# EAGLE design BattleBits_V3_partlyRouted (EAGLE 9.3.2)
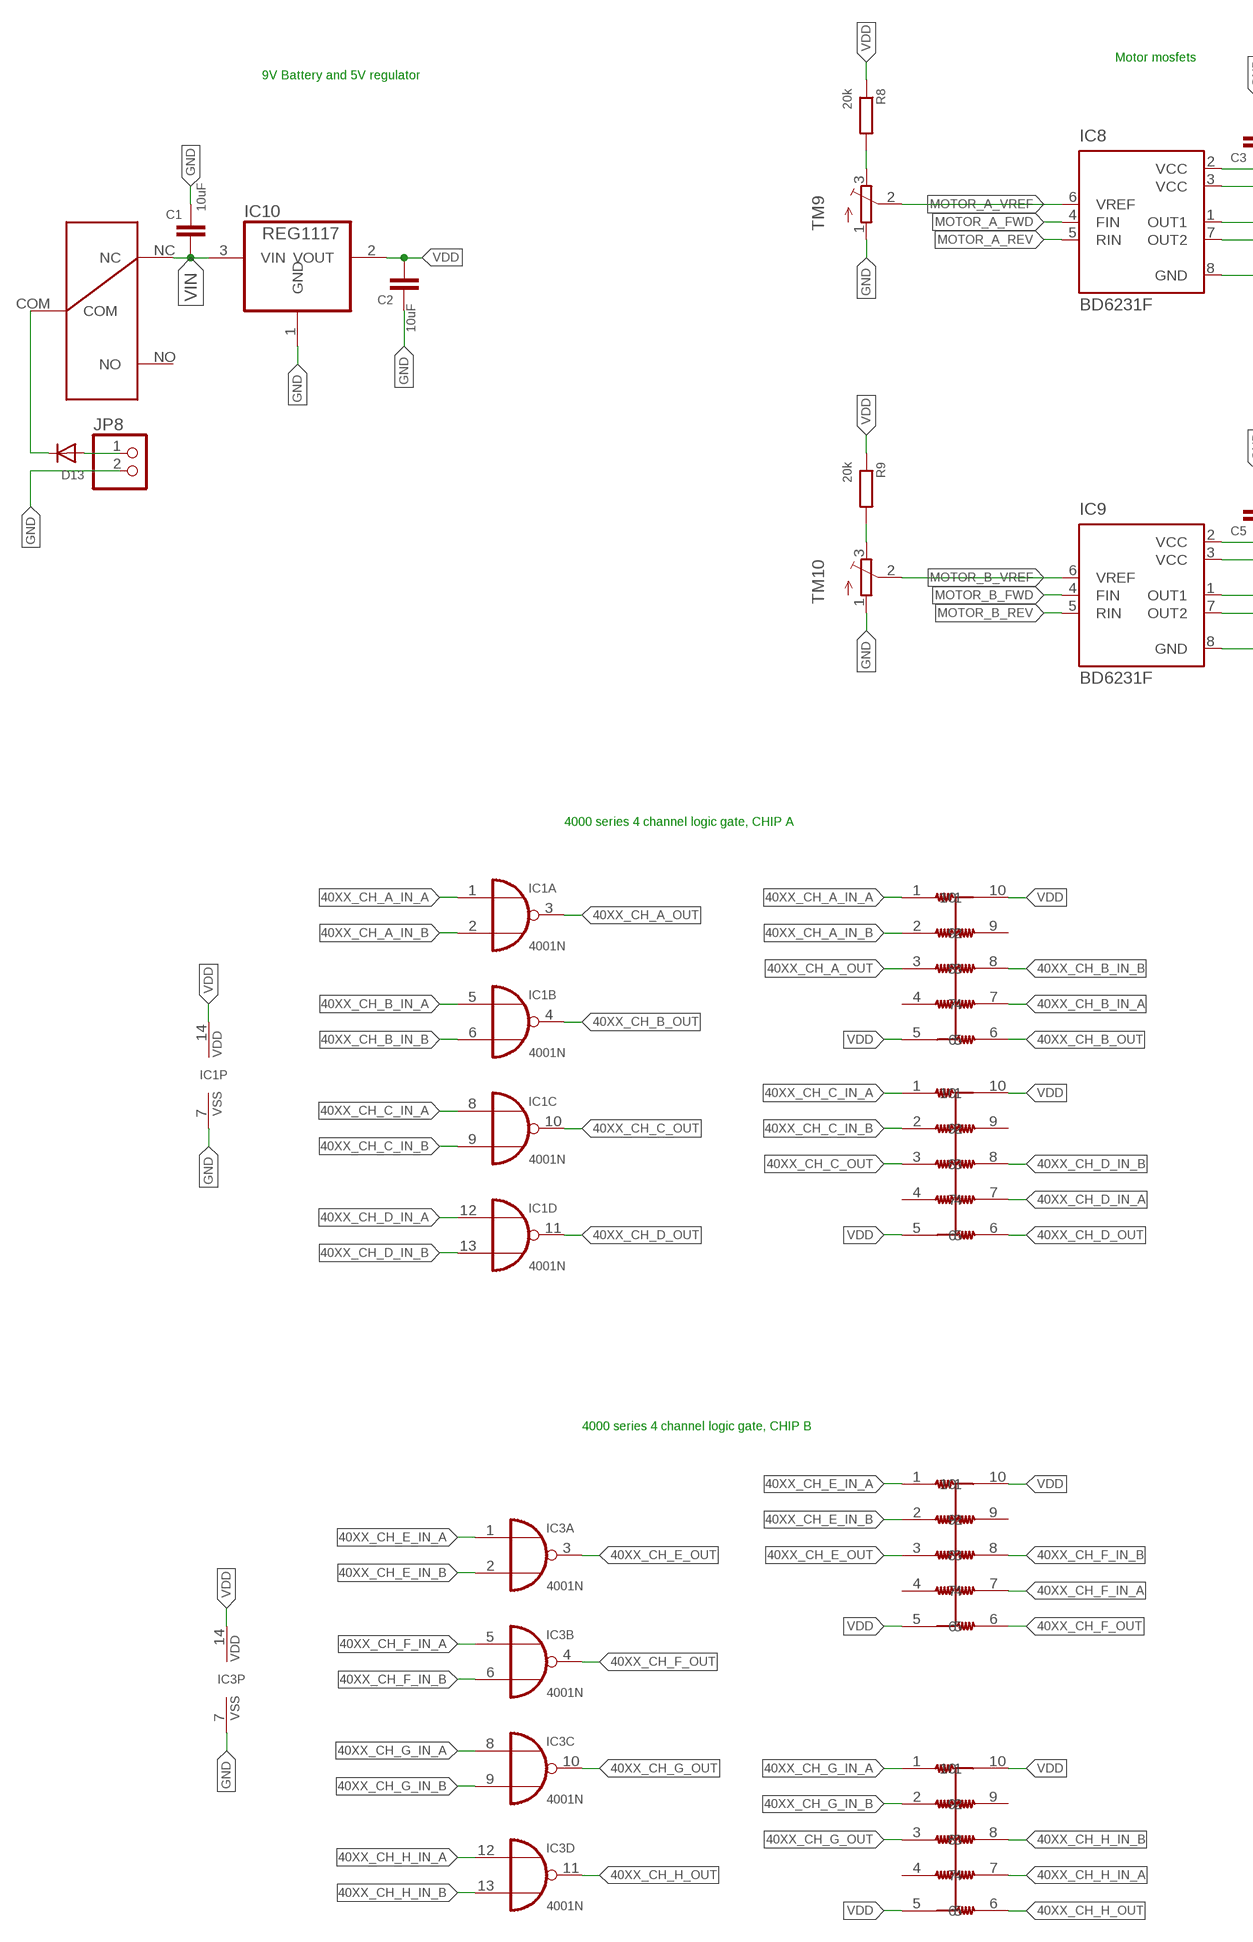
[diagram p0: schematic, sheet 1, part 1 of 2]
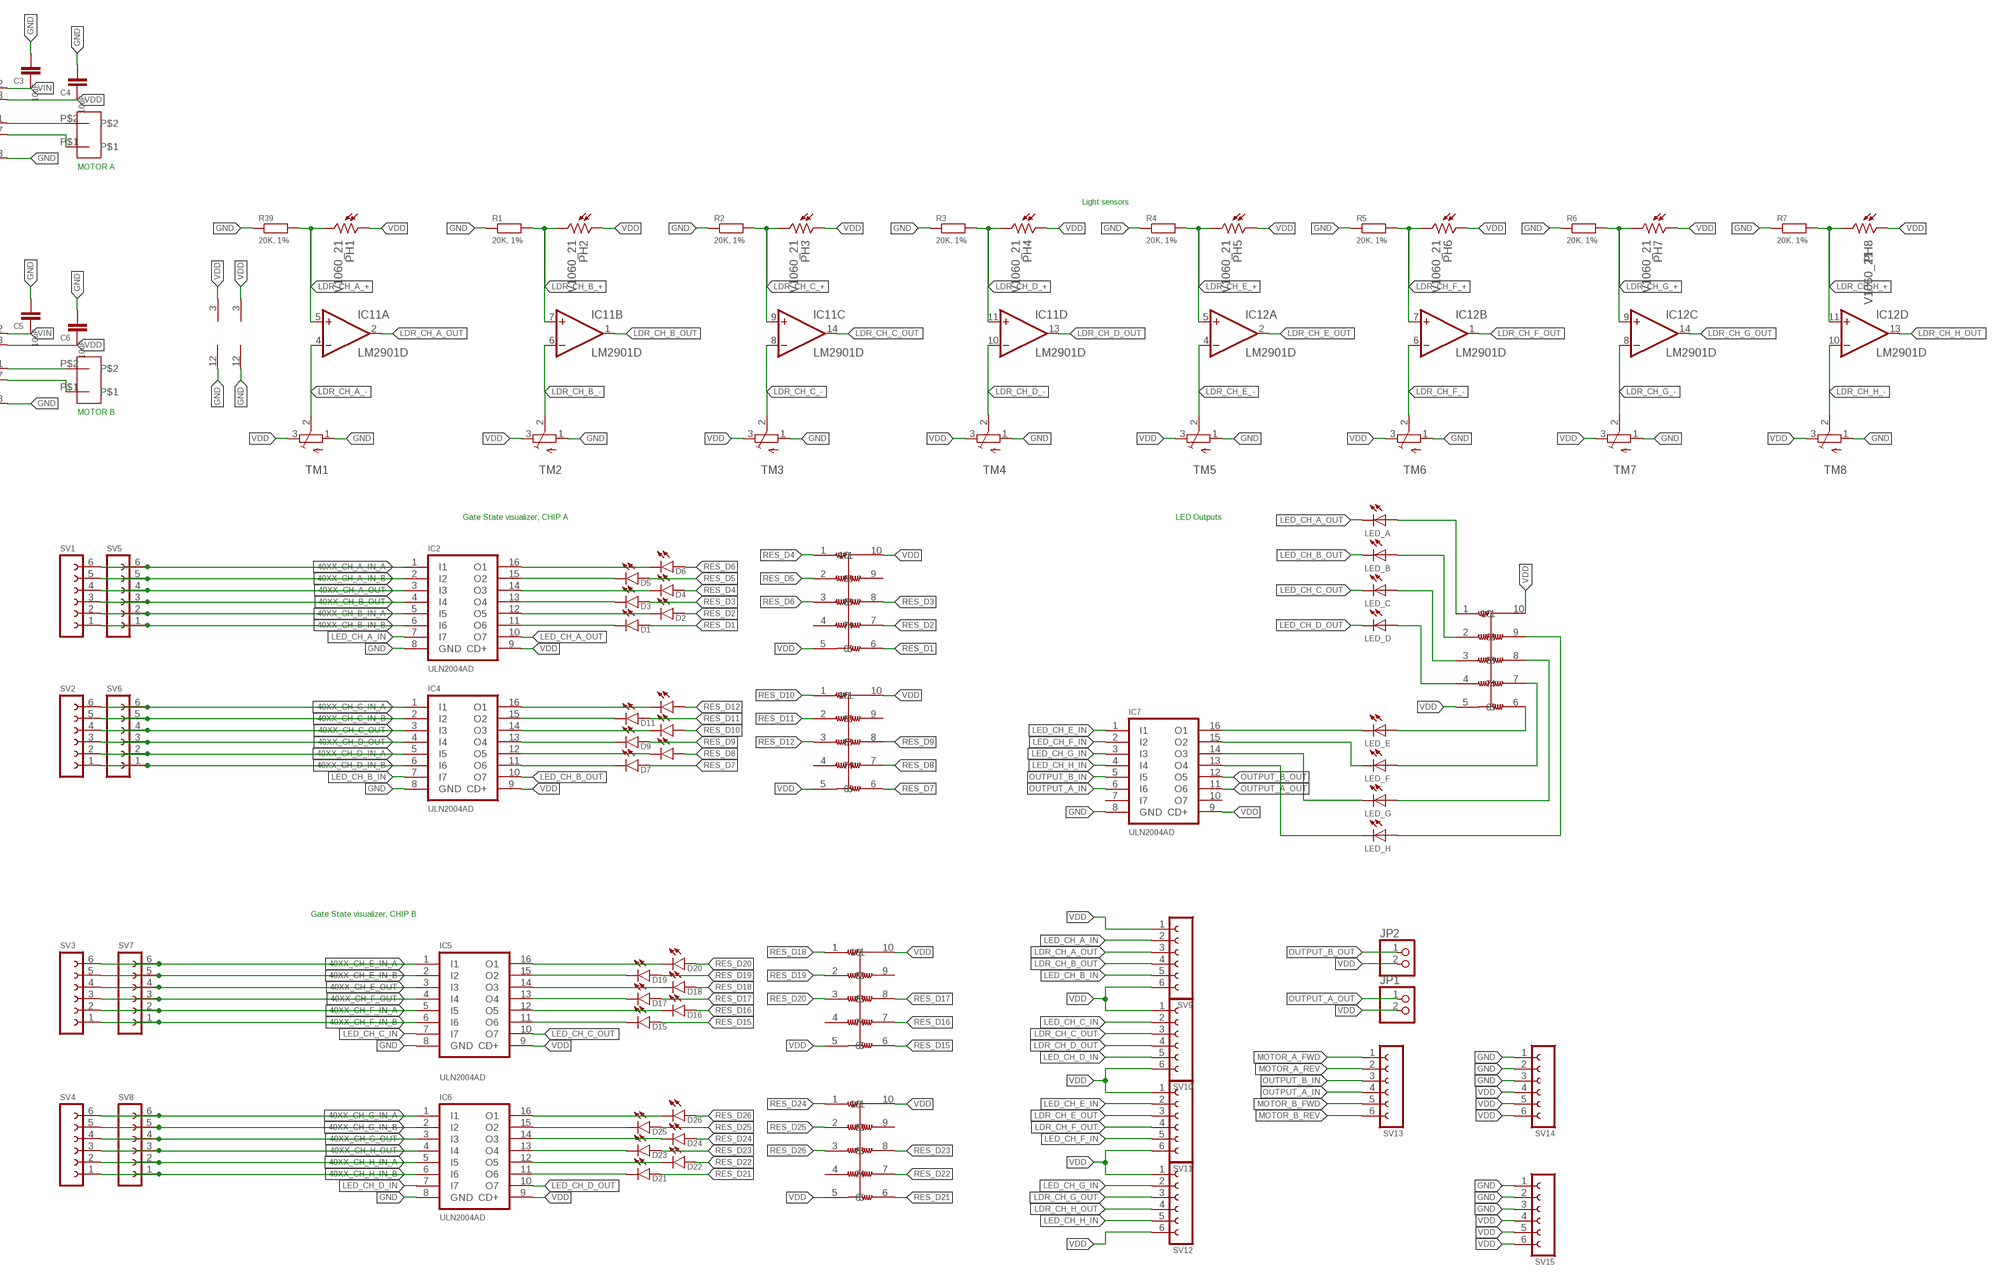
[diagram p1: schematic, sheet 1, part 2 of 2]

## Parts
C1  10uF  C-EUC3216  [C3216]
C2  10uF  C-EUC3216  [C3216]
C3  10uF  C-EUC3216  [C3216]
C4  10uF  C-EUC3216  [C3216]
C5  10uF  C-EUC3216  [C3216]
C6  10uF  C-EUC3216  [C3216]
D1  LED1206  [LED-1206]
D2  LED1206  [LED-1206]
D3  LED1206  [LED-1206]
D4  LED1206  [LED-1206]
D5  LED1206  [LED-1206]
D6  LED1206  [LED-1206]
D7  LED1206  [LED-1206]
D8  LED1206  [LED-1206]
D9  LED1206  [LED-1206]
D10  LED1206  [LED-1206]
D11  LED1206  [LED-1206]
D12  LED1206  [LED-1206]
D13  DIODESMA  [SMADIODE]
D15  LED1206  [LED-1206]
D16  LED1206  [LED-1206]
D17  LED1206  [LED-1206]
D18  LED1206  [LED-1206]
D19  LED1206  [LED-1206]
D20  LED1206  [LED-1206]
D21  LED1206  [LED-1206]
D22  LED1206  [LED-1206]
D23  LED1206  [LED-1206]
D24  LED1206  [LED-1206]
D25  LED1206  [LED-1206]
D26  LED1206  [LED-1206]
IC1  4001N  [DIL14]
IC2  ULN2004AD  [SO16]
IC3  4001N  [DIL14]
IC4  ULN2004AD  [SO16]
IC5  ULN2004AD  [SO16]
IC6  ULN2004AD  [SO16]
IC7  ULN2004AD  [SO16]
IC8  BD6231F  [SOP8]
IC9  BD6231F  [SOP8]
IC10  REG1117  [SOT223]
IC11  LM2901D  [SO14]
IC12  LM2901D  [SO14]
JP1  PINHD-1X2  [1X02]
JP2  PINHD-1X2  [1X02]
JP8  PINHD-1X2  [1X02]
LED_A  LED5MM  [LED5MM]
LED_B  LED5MM  [LED5MM]
LED_C  LED5MM  [LED5MM]
LED_D  LED5MM  [LED5MM]
LED_E  LED5MM  [LED5MM]
LED_F  LED5MM  [LED5MM]
LED_G  LED5MM  [LED5MM]
LED_H  LED5MM  [LED5MM]
PH1  V1060_21  [TO-5_V10]
PH2  V1060_21  [TO-5_V10]
PH3  V1060_21  [TO-5_V10]
PH4  V1060_21  [TO-5_V10]
PH5  V1060_21  [TO-5_V10]
PH6  V1060_21  [TO-5_V10]
PH7  V1060_21  [TO-5_V10]
PH8  V1060_21  [TO-5_V10]
R1  20K, 1%  R-EU_R3216  [R3216]
R2  20K, 1%  R-EU_R3216  [R3216]
R3  20K, 1%  R-EU_R3216  [R3216]
R4  20K, 1%  R-EU_R3216  [R3216]
R5  20K, 1%  R-EU_R3216  [R3216]
R6  20K, 1%  R-EU_R3216  [R3216]
R7  20K, 1%  R-EU_R3216  [R3216]
R8  20k  R-EU_R3216  [R3216]
R9  20k  R-EU_R3216  [R3216]
R39  20K, 1%  R-EU_R3216  [R3216]
SV1  FE06-1  [FE06]
SV2  FE06-1  [FE06]
SV3  FE06-1  [FE06]
SV4  FE06-1  [FE06]
SV5  FE06-1  [FE06]
SV6  FE06-1  [FE06]
SV7  FE06-1  [FE06]
SV8  FE06-1  [FE06]
SV9  FE06-1  [FE06]
SV10  FE06-1  [FE06]
SV11  FE06-1  [FE06]
SV12  FE06-1  [FE06]
SV13  FE06-1  [FE06]
SV14  FE06-1  [FE06]
SV15  FE06-1  [FE06]
TM1  TRIMPOTTC33X  [TC33X]
TM2  TRIMPOTTC33X  [TC33X]
TM3  TRIMPOTTC33X  [TC33X]
TM4  TRIMPOTTC33X  [TC33X]
TM5  TRIMPOTTC33X  [TC33X]
TM6  TRIMPOTTC33X  [TC33X]
TM7  TRIMPOTTC33X  [TC33X]
TM8  TRIMPOTTC33X  [TC33X]
TM9  TRIMPOTTC33X  [TC33X]
TM10  TRIMPOTTC33X  [TC33X]
U$1  MOTOR  [GEARMOTOR]
U$2  MOTOR  [GEARMOTOR]
U$3  10K  EXBA_10P  [EXBA]
U$4  330  EXBA_10P  [EXBA]
U$5  10K  EXBA_10P  [EXBA]
U$6  10K  EXBA_10P  [EXBA]
U$7  SLIDE_SWITCH  [SLIDE_SWITCH]
U$9  10K  EXBA_10P  [EXBA]
U$10  10K  EXBA_10P  [EXBA]
U$11  10K  EXBA_10P  [EXBA]
U$19  10K  EXBA_10P  [EXBA]
U$20  10K  EXBA_10P  [EXBA]

## Nets
40XX_CH_A_IN_A [SIGNAL]: IC1.1(A:I0) IC2.1(I1) SV1.6 SV5.6 U$3.1
40XX_CH_A_IN_B [SIGNAL]: IC1.2(A:I1) IC2.2(I2) SV1.5 SV5.5 U$3.2
40XX_CH_A_OUT [SIGNAL]: IC1.3(A:O) IC2.3(I3) SV1.4 SV5.4 U$3.3
40XX_CH_B_IN_A [SIGNAL]: IC1.5(B:I0) IC2.5(I5) SV1.2 SV5.2 U$3.7
40XX_CH_B_IN_B [SIGNAL]: IC1.6(B:I1) IC2.6(I6) SV1.1 SV5.1 U$3.8
40XX_CH_B_OUT [SIGNAL]: IC1.4(B:O) IC2.4(I4) SV1.3 SV5.3 U$3.6
40XX_CH_C_IN_A [SIGNAL]: IC1.8(C:I0) IC4.1(I1) SV2.6 SV6.6 U$10.1
40XX_CH_C_IN_B [SIGNAL]: IC1.9(C:I1) IC4.2(I2) SV2.5 SV6.5 U$10.2
40XX_CH_C_OUT [SIGNAL]: IC1.10(C:O) IC4.3(I3) SV2.4 SV6.4 U$10.3
40XX_CH_D_IN_A [SIGNAL]: IC1.12(D:I0) IC4.5(I5) SV2.2 SV6.2 U$10.7
40XX_CH_D_IN_B [SIGNAL]: IC1.13(D:I1) IC4.6(I6) SV2.1 SV6.1 U$10.8
40XX_CH_D_OUT [SIGNAL]: IC1.11(D:O) IC4.4(I4) SV2.3 SV6.3 U$10.6
40XX_CH_E_IN_A [SIGNAL]: IC3.1(A:I0) IC5.1(I1) SV3.6 SV7.6 U$11.1
40XX_CH_E_IN_B [SIGNAL]: IC3.2(A:I1) IC5.2(I2) SV3.5 SV7.5 U$11.2
40XX_CH_E_OUT [SIGNAL]: IC3.3(A:O) IC5.3(I3) SV3.4 SV7.4 U$11.3
40XX_CH_F_IN_A [SIGNAL]: IC3.5(B:I0) IC5.5(I5) SV3.2 SV7.2 U$11.7
40XX_CH_F_IN_B [SIGNAL]: IC3.6(B:I1) IC5.6(I6) SV3.1 SV7.1 U$11.8
40XX_CH_F_OUT [SIGNAL]: IC3.4(B:O) IC5.4(I4) SV3.3 SV7.3 U$11.6
40XX_CH_G_IN_A [SIGNAL]: IC3.8(C:I0) IC6.1(I1) SV4.6 SV8.6 U$20.1
40XX_CH_G_IN_B [SIGNAL]: IC3.9(C:I1) IC6.2(I2) SV4.5 SV8.5 U$20.2
40XX_CH_G_OUT [SIGNAL]: IC3.10(C:O) IC6.3(I3) SV4.4 SV8.4 U$20.3
40XX_CH_H_IN_A [SIGNAL]: IC3.12(D:I0) IC6.5(I5) SV4.2 SV8.2 U$20.7
40XX_CH_H_IN_B [SIGNAL]: IC3.13(D:I1) IC6.6(I6) SV4.1 SV8.1 U$20.8
40XX_CH_H_OUT [SIGNAL]: IC3.11(D:O) IC6.4(I4) SV4.3 SV8.3 U$20.6
GND: C1.1 C2.1 C3.2 C4.2 C5.2 C6.2 IC1.7(P:VSS) IC2.8(GND) IC3.7(P:VSS) IC4.8(GND) IC5.8(GND) IC6.8(GND) IC7.8(GND) IC8.8(GND) IC9.8(GND) IC10.1(GND) IC11.12(P:V-) IC12.12(P:V-) JP8.2 R1.1 R2.1 R3.1 R4.1 R5.1 R6.1 R7.1 R39.1 SV14.1 SV14.2 SV14.3 SV15.1 SV15.2 SV15.3 TM1.1(A) TM2.1(A) TM3.1(A) TM4.1(A) TM5.1(A) TM6.1(A) TM7.1(A) TM8.1(A) TM9.1(A) TM10.1(A)
LDR_CH_A_+ [SIGNAL]: IC11.5(A:+IN) PH1.2 R39.2
LDR_CH_A_-: IC11.4(A:-IN) TM1.2(S)
LDR_CH_A_OUT [SIGNAL]: IC11.2(A:OUT) SV9.3
LDR_CH_B_+ [SIGNAL]: IC11.7(B:+IN) PH2.2 R1.2
LDR_CH_B_-: IC11.6(B:-IN) TM2.2(S)
LDR_CH_B_OUT: IC11.1(B:OUT) SV9.4
LDR_CH_C_+ [SIGNAL]: IC11.9(C:+IN) PH3.2 R2.2
LDR_CH_C_-: IC11.8(C:-IN) TM3.2(S)
LDR_CH_C_OUT [SIGNAL]: IC11.14(C:OUT) SV10.3
LDR_CH_D_+ [SIGNAL]: IC11.11(D:+IN) PH4.2 R3.2
LDR_CH_D_-: IC11.10(D:-IN) TM4.2(S)
LDR_CH_D_OUT: IC11.13(D:OUT) SV10.4
LDR_CH_E_+ [SIGNAL]: IC12.5(A:+IN) PH5.2 R4.2
LDR_CH_E_-: IC12.4(A:-IN) TM5.2(S)
LDR_CH_E_OUT [SIGNAL]: IC12.2(A:OUT) SV11.3
LDR_CH_F_+ [SIGNAL]: IC12.7(B:+IN) PH6.2 R5.2
LDR_CH_F_-: IC12.6(B:-IN) TM6.2(S)
LDR_CH_F_OUT: IC12.1(B:OUT) SV11.4
LDR_CH_G_+ [SIGNAL]: IC12.9(C:+IN) PH7.2 R6.2
LDR_CH_G_-: IC12.8(C:-IN) TM7.2(S)
LDR_CH_G_OUT [SIGNAL]: IC12.14(C:OUT) SV12.3
LDR_CH_H_+ [SIGNAL]: IC12.11(D:+IN) PH8.2 R7.2
LDR_CH_H_-: IC12.10(D:-IN) TM8.2(S)
LDR_CH_H_OUT: IC12.13(D:OUT) SV12.4
LED_CH_A_IN [SIGNAL]: IC2.7(I7) SV9.2
LED_CH_A_OUT: IC2.10(O7) LED_A.K(C)
LED_CH_B_IN [SIGNAL]: IC4.7(I7) SV9.5
LED_CH_B_OUT: IC4.10(O7) LED_B.K(C)
LED_CH_C_IN [SIGNAL]: IC5.7(I7) SV10.2
LED_CH_C_OUT: IC5.10(O7) LED_C.K(C)
LED_CH_D_IN [SIGNAL]: IC6.7(I7) SV10.5
LED_CH_D_OUT: IC6.10(O7) LED_D.K(C)
LED_CH_E_IN [SIGNAL]: IC7.1(I1) SV11.2
LED_CH_F_IN [SIGNAL]: IC7.2(I2) SV11.5
LED_CH_G_IN [SIGNAL]: IC7.3(I3) SV12.2
LED_CH_H_IN [SIGNAL]: IC7.4(I4) SV12.5
MOTOR_A_FWD [SIGNAL]: IC8.4(FIN) SV13.1
MOTOR_A_REV: IC8.5(RIN) SV13.2
MOTOR_A_VREF: IC8.6(VREF) TM9.2(S)
MOTOR_B_FWD: IC9.4(FIN) SV13.5
MOTOR_B_REV [SIGNAL]: IC9.5(RIN) SV13.6
MOTOR_B_VREF: IC9.6(VREF) TM10.2(S)
N$1: R8.2 TM9.3(E)
N$3: R9.2 TM10.3(E)
N$5: D6.C IC2.16(O1)
N$6: IC9.1(OUT1) U$2.P$2
N$7: IC9.7(OUT2) U$2.P$1
N$8: D5.C IC2.15(O2)
N$9: D4.C IC2.14(O3)
N$10: D3.C IC2.13(O4)
N$11: D2.C IC2.12(O5)
N$12: D1.C IC2.11(O6)
N$13: D26.C IC6.16(O1)
N$14: D12.C IC4.16(O1)
N$15: D11.C IC4.15(O2)
N$16: D10.C IC4.14(O3)
N$17: D9.C IC4.13(O4)
N$18: D8.C IC4.12(O5)
N$19: D7.C IC4.11(O6)
N$21: D24.C IC6.14(O3)
N$23: D20.C IC5.16(O1)
N$25: D19.C IC5.15(O2)
N$27: D18.C IC5.14(O3)
N$29: D17.C IC5.13(O4)
N$31: D16.C IC5.12(O5)
N$32: D15.C IC5.11(O6)
N$33: D25.C IC6.15(O2)
N$34: D23.C IC6.13(O4)
N$35: D22.C IC6.12(O5)
N$38: D21.C IC6.11(O6)
N$44: LED_A.A U$4.1
N$45: LED_B.A U$4.2
N$46: IC7.16(O1) LED_E.K(C)
N$47: IC7.15(O2) LED_F.K(C)
N$48: IC7.14(O3) LED_G.K(C)
N$49: IC7.13(O4) LED_H.K(C)
N$50: LED_C.A U$4.3
N$51: LED_D.A U$4.4
N$52: LED_E.A U$4.6
N$53: LED_F.A U$4.7
N$54: LED_G.A U$4.8
N$55: LED_H.A U$4.9
N$61: D13.A JP8.1
N$82: IC8.1(OUT1) U$1.P$2
N$83: IC8.7(OUT2) U$1.P$1
OUTPUT_A_IN: IC7.6(I6) SV13.4
OUTPUT_A_OUT: IC7.11(O6) JP1.1
OUTPUT_B_IN: IC7.5(I5) SV13.3
OUTPUT_B_OUT: IC7.12(O5) JP2.1
RES_D1: D1.A U$19.6
RES_D2: D2.A U$19.7
RES_D3: D3.A U$19.8
RES_D4: D4.A U$19.1
RES_D5: D5.A U$19.2
RES_D6: D6.A U$19.3
RES_D7: D7.A U$5.6
RES_D8: D8.A U$5.7
RES_D9: D9.A U$5.8
RES_D10: D10.A U$5.1
RES_D11: D11.A U$5.2
RES_D12: D12.A U$5.3
RES_D15: D15.A U$6.6
RES_D16: D16.A U$6.7
RES_D17: D17.A U$6.8
RES_D18: D18.A U$6.1
RES_D19: D19.A U$6.2
RES_D20: D20.A U$6.3
RES_D21: D21.A U$9.6
RES_D22: D22.A U$9.7
RES_D23: D23.A U$9.8
RES_D24: D24.A U$9.1
RES_D25: D25.A U$9.2
RES_D26: D26.A U$9.3
VBAT: D13.C U$7.COM
VDD: C2.2 C4.1 C6.1 IC1.14(P:VDD) IC2.9(CD+) IC3.14(P:VDD) IC4.9(CD+) IC5.9(CD+) IC6.9(CD+) IC7.9(CD+) IC8.3(VCC) IC9.3(VCC) IC10.2(VOUT) IC11.3(P:V+) IC12.3(P:V+) JP1.2 JP2.2 PH1.1 PH2.1 PH3.1 PH4.1 PH5.1 PH6.1 PH7.1 PH8.1 R8.1 R9.1 SV9.1 SV9.6 SV10.1 SV10.6 SV11.1 SV11.6 SV12.1 SV12.6 SV14.4 SV14.5 SV14.6 SV15.4 SV15.5 SV15.6 TM1.3(E) TM2.3(E) TM3.3(E) TM4.3(E) TM5.3(E) TM6.3(E) TM7.3(E) TM8.3(E) U$3.5 U$3.10 U$4.5 U$4.10 U$5.5 U$5.10 U$6.5 U$6.10 U$9.5 U$9.10 U$10.5 U$10.10 U$11.5 U$11.10 U$19.5 U$19.10 U$20.5 U$20.10
VIN: C1.2 C3.1 C5.1 IC8.2(VCC) IC9.2(VCC) IC10.3(VIN) U$7.NC
Unconnected: IC7.7(I7) IC7.10(O7) U$3.4 U$3.9 U$5.4 U$5.9 U$6.4 U$6.9 U$7.NO U$9.4 U$9.9 U$10.4 U$10.9 U$11.4 U$11.9 U$19.4 U$19.9 U$20.4 U$20.9

## Notes on the sheet
- Motor mosfets
- 9V Battery and 5V regulator
- MOTOR A
- Light sensors
- MOTOR B
- 4000 series 4 channel logic gate, CHIP A | Gate State visualizer, CHIP A | LED Outputs
- 4000 series 4 channel logic gate, CHIP B | Gate State visualizer, CHIP B

## Library data of the parts
C1-C6 = rcl:C-EU: CAPACITOR, European symbol; SPICEPREFIX: C
D1-D12 D15-D26 = SparkFun-LED:LED: LED (Generic) Standard schematic elements and footprints for 5mm, 3mm, 1206, and 0603 sized LEDs. Generic LEDs with no color specified.
D13 = adafruit:DIODE: Diode SMADIODE - SMA Surface Mount Package 20V 1A Schottky Diode Digikey: 641-1014-6-ND DO-1N4148 - Through Hole Small Current Diode SOD-123 20V 1 A (.5mV Vf) Schottky Diode - Digikey: MBRX120TPMSCT-ND SOD-323 10V 570mA (.38mV Vf, 3ns) Schottky Diode - Digikey: ZLLS410CT-ND SOD-523 30V 30mA Schottky Diode (RB751S-40TE61) - Digikey: RB751S-40TE61CT-ND SOT23-R/W - SOT23 Package (R = Solder Paste/Reflow Ovens, W = Hand-Soldering) BAT54Film 40V 300mA - Digikey: 497-7162-1-ND
IC1 IC3 = 40xx:4001: Quad 2-input NOR
IC2 IC4-IC7 = uln-udn:ULN2004A: DRIVER ARRAY
IC8 IC9 = rohm:BD623*F: H-bridge driver for brush motors Source: http://www.rohm.com/products/databook/motor/pdf/bd623x_series-e.pdf; MPN: BD6231F-E2; OC_FARNELL: 1716265; OC_NEWARK: 15R0530
IC10 = burr-brown:REG1117: 800mA and 1A Low Dropout (LDO) Positive Regulator 1.8V, 2.5V, 2.85V, 3.3V, 5V, and Adj; MPN: REG1117; OC_FARNELL: 1097566; OC_NEWARK: 14P6981
IC11 IC12 = linear:LM2901: COMPARATOR
JP1 JP2 JP8 = pinhead:PINHD-1X2: PIN HEADER
LED_A LED_B LED_C LED_D LED_E LED_F LED_G LED_H = adafruit:LED: LED OSRAM: - CHIPLED LG R971, LG N971, LY N971, LG Q971, LY Q971, LO R971, LY R971 LH N974, LH R974 LS Q976, LO Q976, LY Q976 LO Q996 - Hyper CHIPLED LW Q18S LB Q993, LB Q99A, LB R99A - SideLED LS A670, LO A670, LY A670, LG A670, LP A670 LB A673, LV A673, LT A673, LW A673 LH A674 LY A675 LS A676, LA A676, LO A676, LY A676, LW A676 LS A679, LY A679, LG A679 - Hyper Micro SIDELED® LS Y876, LA Y876, LO Y876, LY Y876 LT Y87S - SmartLED LW L88C, LW L88S LB L89C, LB L89S, LG L890 LS L89K, LO L89K, LY L89K LS L896, LA L896, LO L896, LY L896 - TOPLED LS T670, LO T670, LY T670, LG T670, LP T670 LSG T670, LSP T670, LSY T670, LOP T670, LYG T670 LG T671, LOG T671, LSG T671 LB T673, LV T673, LT T673, LW T673 LH T674 LS T676, LA T676, LO T676, LY T676, LB T676, LH T676, LSB T676, LW T676 LB T67C, LV T67C, LT T67C, LS T67K, LO T67K, LY T67K, LW E67C LS E67B, LA E67B, LO E67B, LY E67B, LB E67C, LV E67C, LT E67C LW T67C LS T679, LY T679, LG T679 LS T770, LO T770, LY T770, LG T770, LP T770 LB T773, LV T773, LT T773, LW T773 LH T774 LS E675, LA E675, LY E675, LS T675 LS T776, LA T776, LO T776, LY T776, LB T776 LHGB T686 LT T68C, LB T68C - Hyper Mini TOPLED® LB M676 - Mini TOPLED Santana® LG M470 LS M47K, LO M47K, LY M47K Source: http://www.osram.convergy.de/
PH1-PH8 = photo-elements:?1060*: Sensor Street Light control Source: http://optoelectronics.perkinelmer.com/content/Datasheets/DTS_PhotocellsB1060.pdf
R1-R9 R39 = rcl:R-EU_: RESISTOR, European symbol; SPICEPREFIX: R
SV1-SV15 = con-lsta:FE06-1: FEMALE HEADER; OC_FARNELL: unknown; OC_NEWARK: unknown
TM1-TM10 = adafruit:TRIMPOT: SMT trimmer potentiometer part number TC33X http://www.ladyada.net/library/eagle
U$1 U$2 = gearmotor:MOTOR
U$3-U$6 U$9-U$11 U$19 U$20 = EXBA:EXBA_10P
U$7 = SlideSwitch:SLIDE_SWITCH

## Net classes
0 PWR: width 0.305 mm, drill 0.3 mm, clearance 0.152 mm
1 SIGNAL: width 0.305 mm, drill 0.3 mm, clearance 0.152 mm

## Board
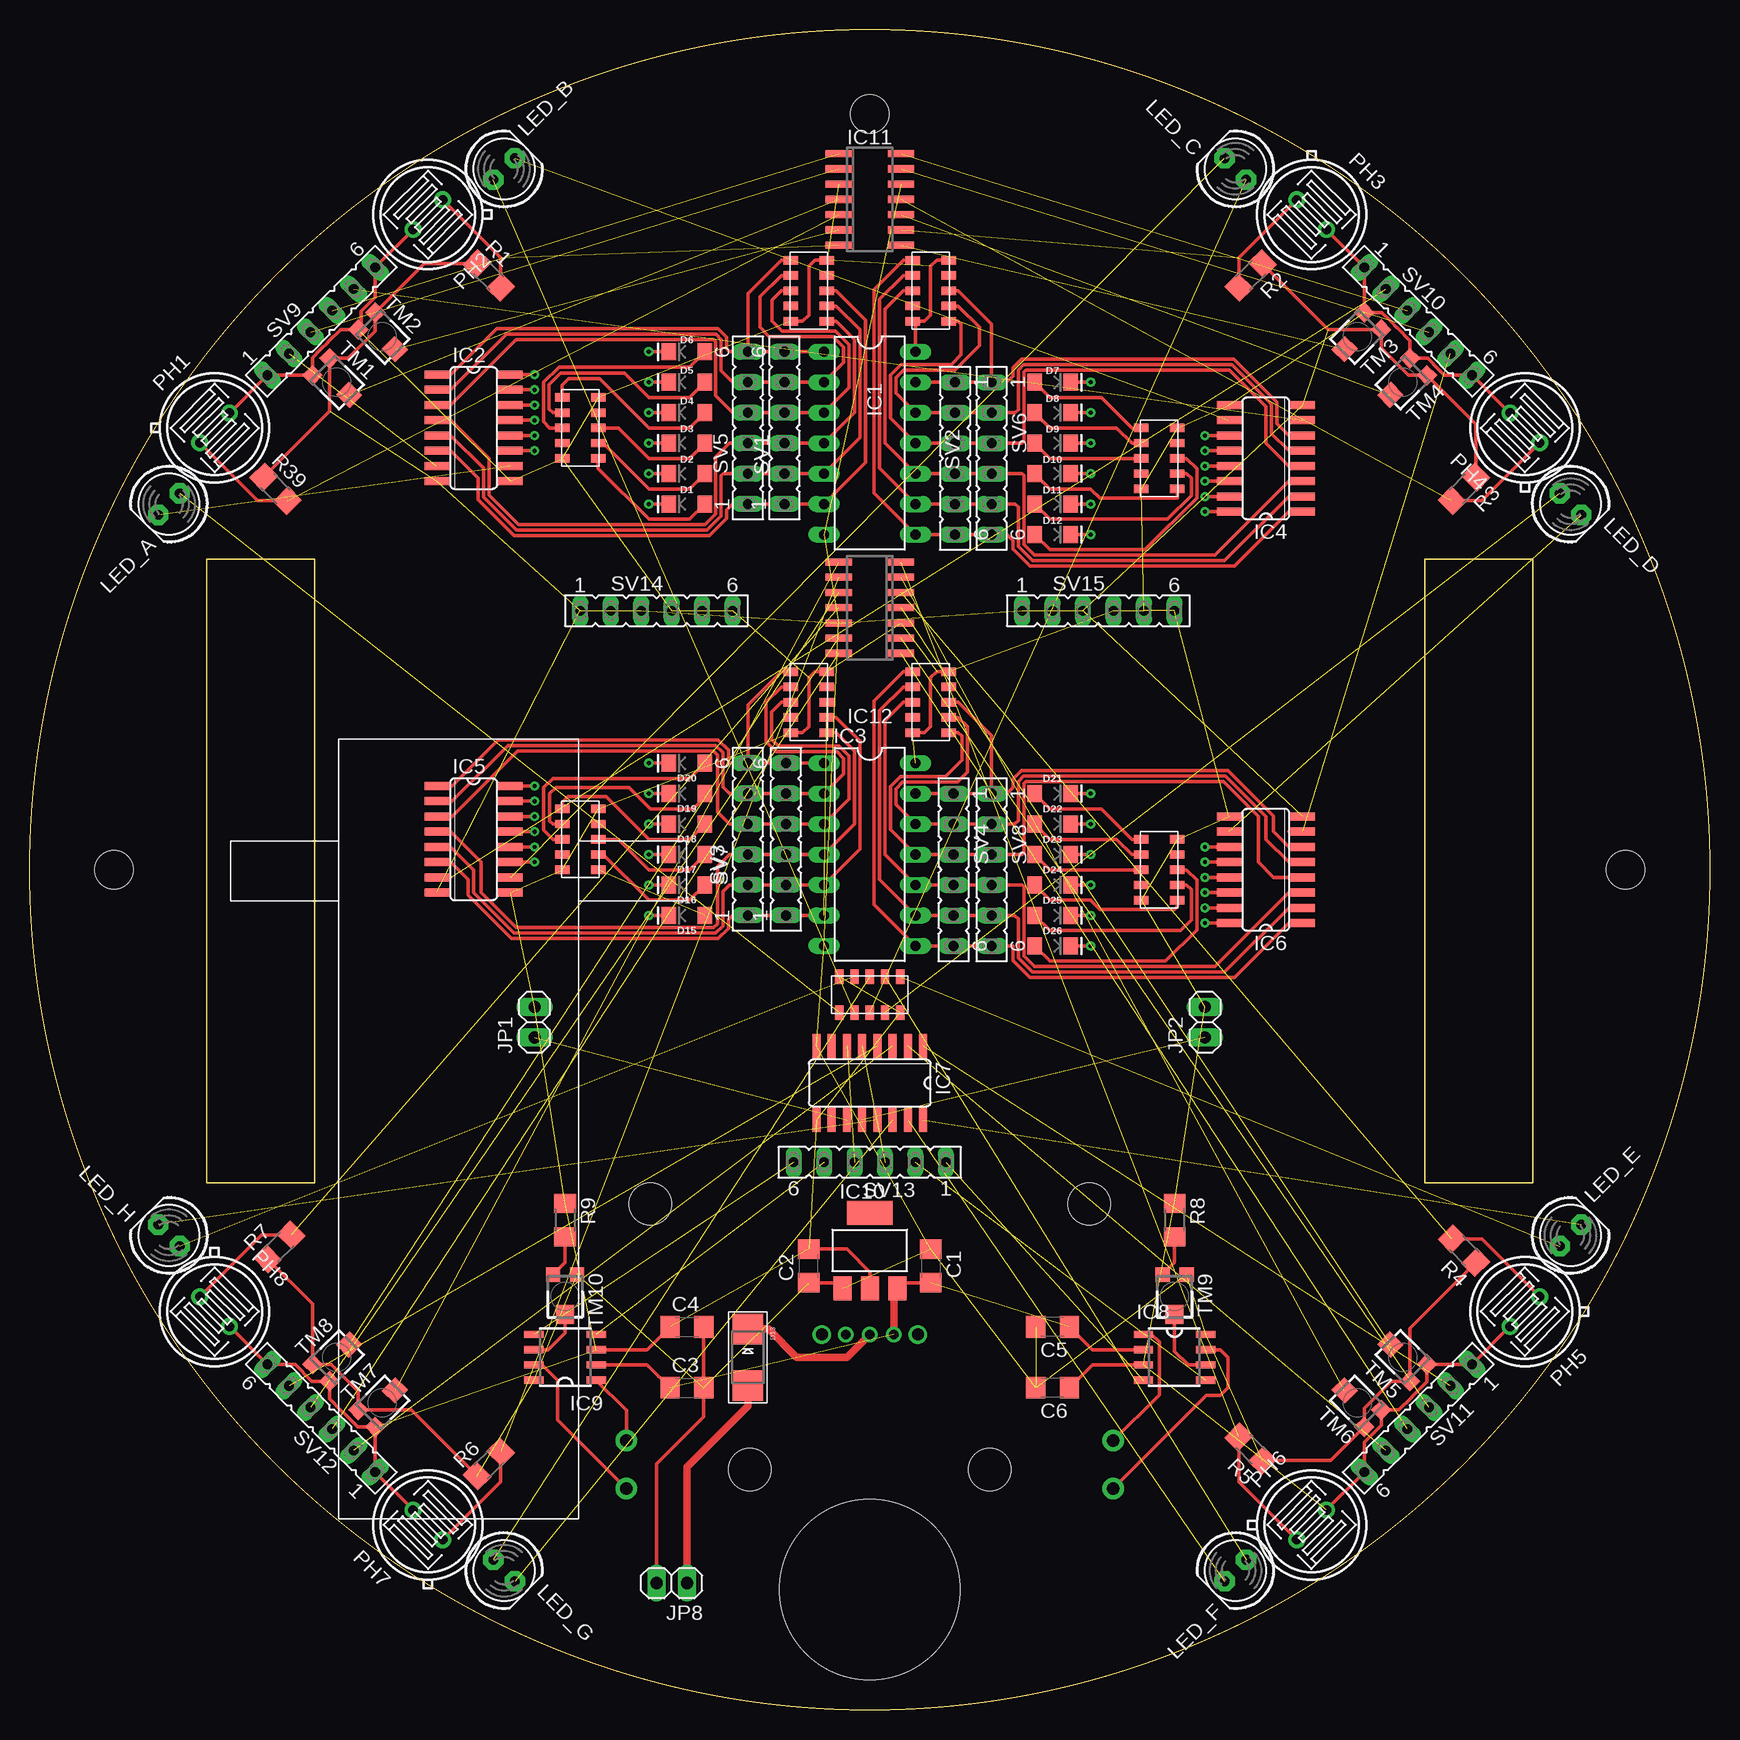
[diagram p2: board, top side]
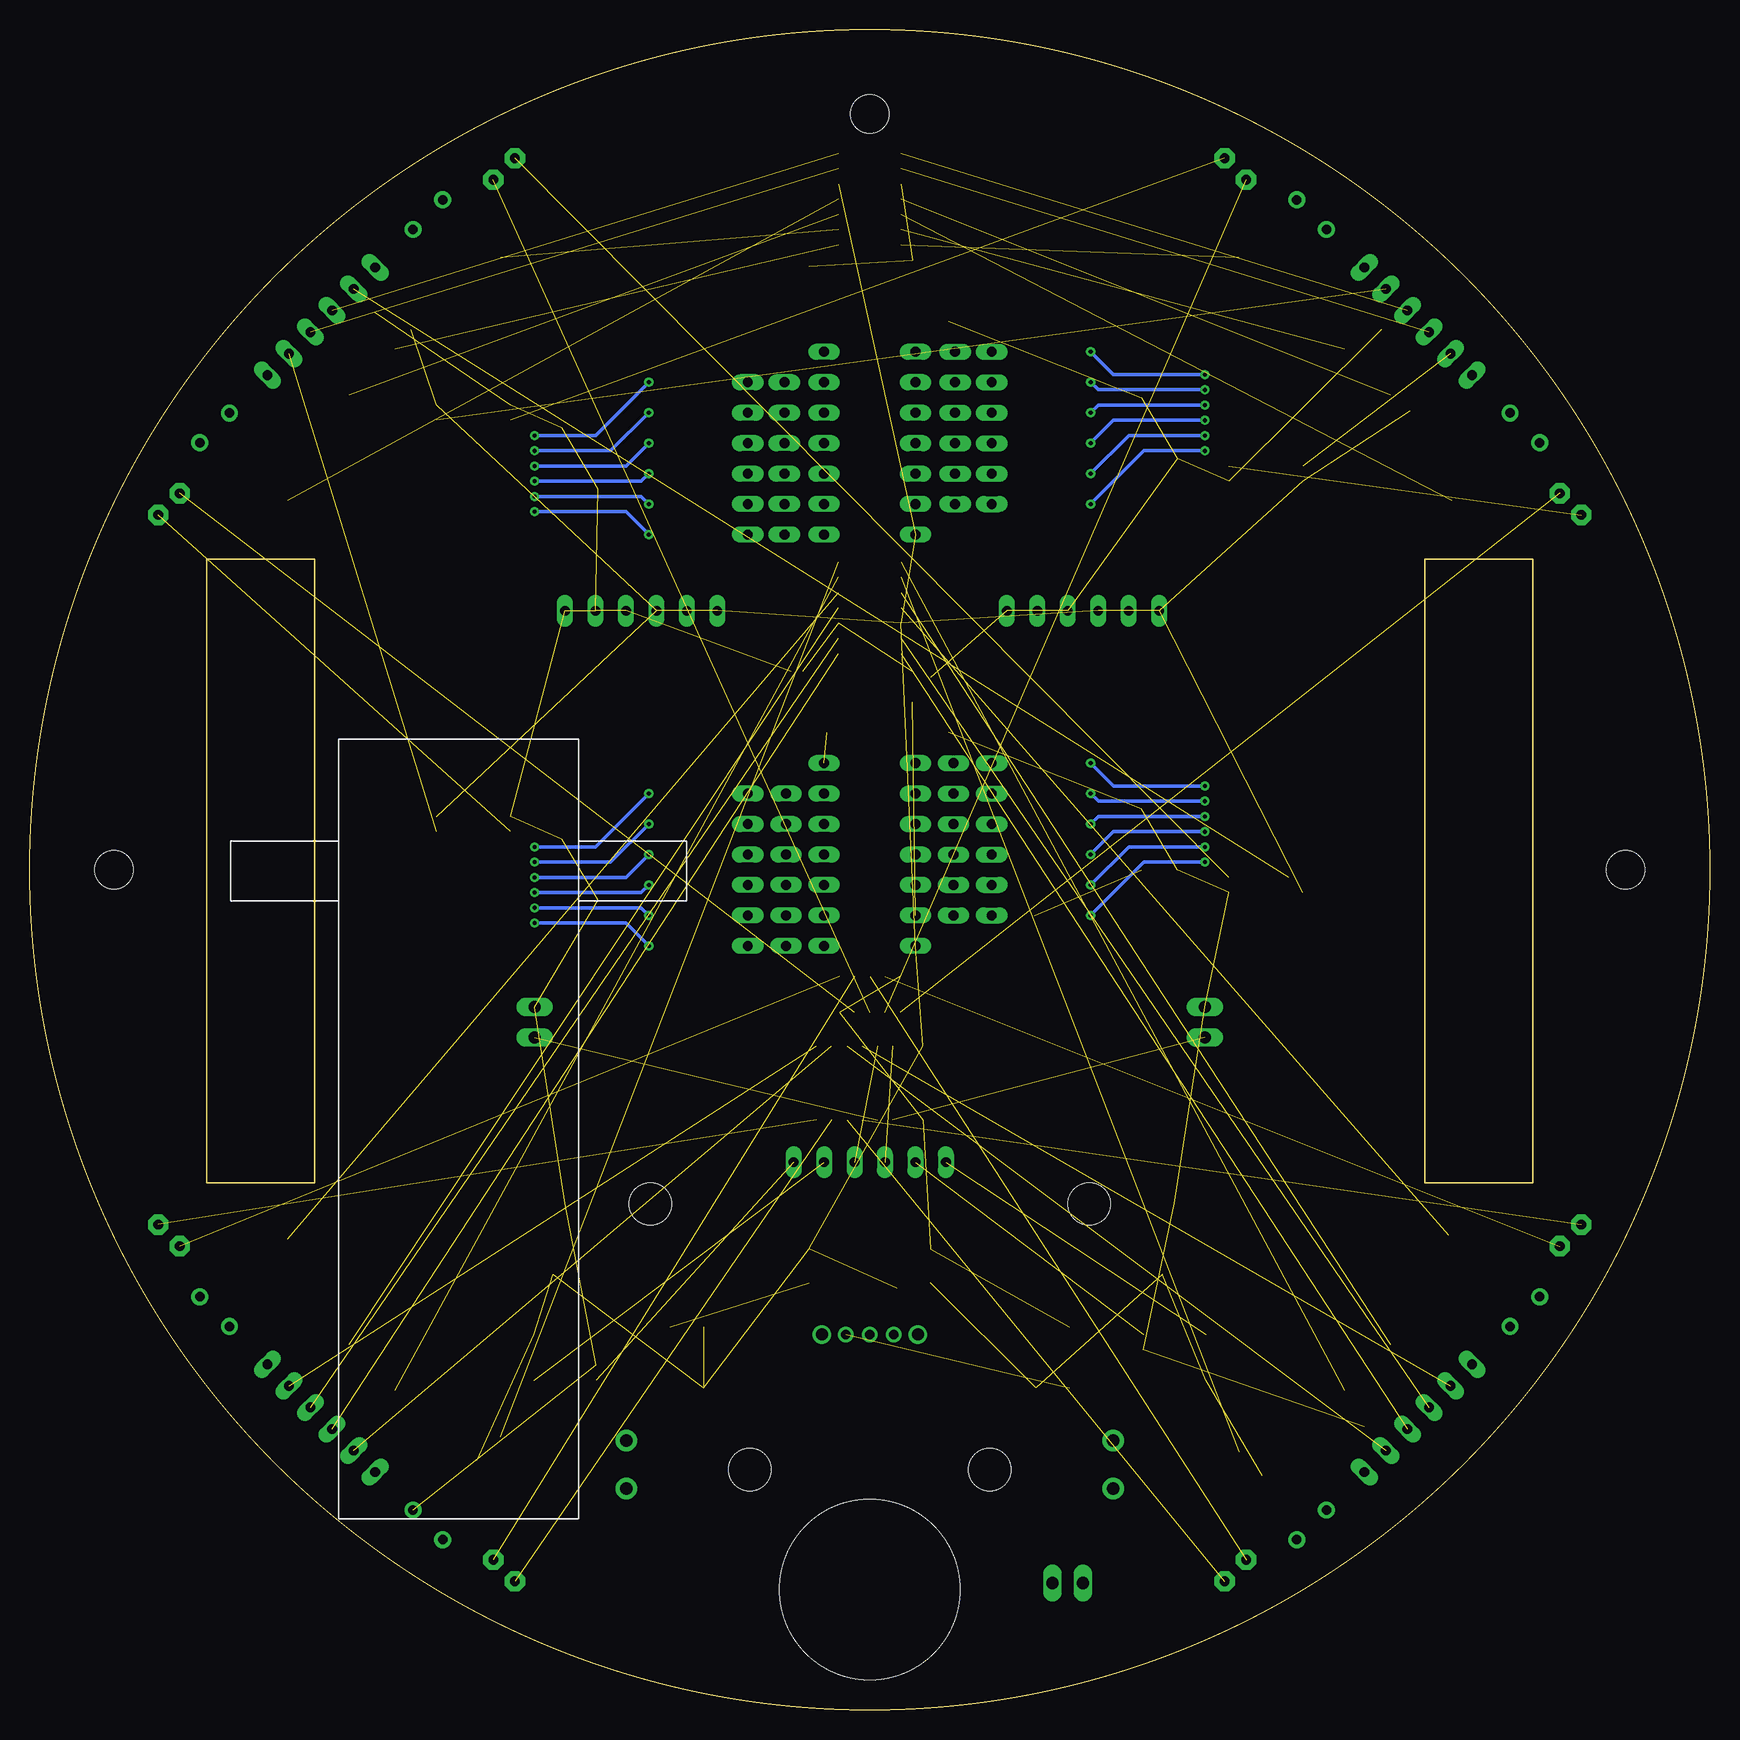
[diagram p3: board, bottom side, seen from below]

Size 140 x 140 mm. Coordinates in mm from the lower left corner, seen from the top.
Outline: circle at 70,70 radius 70
Copper layers (1*16): Top 0.035mm / dielectric 1.5mm / Bottom 0.035mm
Design rules "default *": minimum track width 6mil, minimum drill 0.35mm, track to track 6mil, track to pad 6mil, pad to pad 6mil, via to via 6mil, smd to smd 6mil, copper to edge 40mil, drill to drill 6mil, minimum pad ring 10mil, minimum via ring 8mil, stop-mask expansion 4mil, vias tented up to drill 0mil, thermal gap 10mil
Holes 15 mm at 70,10
Holes 3.5 mm at 60,20 80,20
Holes 3.2 mm at 7,70 133,70 70,133

### Footprints (pad centres in the part's own frame; a part is rotated, then mirrored left to right if it is on the bottom)
C3216 = smd 1.6 x 1.8: 1 -1.4,0; 2 1.4,0
LED-1206 = smd 1.2 x 1.4: A -1.5,0; C 1.5,0
SMADIODE = smd 2.54 x 2.54: A 2.349,0; C -2.349,0
DIL14 = drill 0.813 long: 1 -7.62,-3.81; 2 -5.08,-3.81; 3 -2.54,-3.81; 4 0,-3.81; 5 2.54,-3.81; 6 5.08,-3.81; 7 7.62,-3.81; 8 7.62,3.81; 9 5.08,3.81; 10 2.54,3.81; 11 0,3.81; 12 -2.54,3.81; 13 -5.08,3.81; 14 -7.62,3.81
SO16 = smd 0.66 x 2.032: 1 -4.445,-3.073; 2 -3.175,-3.073; 3 -1.905,-3.073; 4 -0.635,-3.073; 5 0.635,-3.073; 6 1.905,-3.073; 7 3.175,-3.073; 8 4.445,-3.073; 9 4.445,3.073; 10 3.175,3.073; 11 1.905,3.073; 12 0.635,3.073; 13 -0.635,3.073; 14 -1.905,3.073; 15 -3.175,3.073; 16 -4.445,3.073
SOP8 = smd 0.6 x 1.6: 1 -1.905,-2.6; 2 -0.635,-2.6; 3 0.635,-2.6; 4 1.905,-2.6; 5 1.905,2.6; 6 0.635,2.6; 7 -0.635,2.6; 8 -1.905,2.6
SOT223 = smd 1.499 x 2.007: 1 -2.261,-3.15; 2 0.025,-3.15; 3 2.311,-3.15 | smd 3.81 x 2.007: 4 0,3.15
SO14 = smd 0.6 x 2.2: 1 -3.81,-2.6; 2 -2.54,-2.6; 3 -1.27,-2.6; 4 0,-2.6; 5 1.27,-2.6; 6 2.54,-2.6; 7 3.81,-2.6; 8 3.81,2.6; 9 2.54,2.6; 10 1.27,2.6; 11 0,2.6; 12 -1.27,2.6; 13 -2.54,2.6; 14 -3.81,2.6
1X02 = drill 1.016 long: 1 -1.27,0; 2 1.27,0
LED5MM = drill 0.813 pad 1.676 octagon: A -1.27,0; K 1.27,0
TO-5_V10 = drill 0.8 pad 1.4: 1 -1.75,0; 2 1.75,0
R3216 = smd 1.6 x 1.8: 1 -1.4,0; 2 1.4,0
FE06 = drill 0.813 long: 1 -6.35,0; 2 -3.81,0; 3 -1.27,0; 4 1.27,0; 5 3.81,0; 6 6.35,0
TC33X = smd 1.2 x 1.2: 1 -1,-1.825; 3 1,-1.825 | smd 1.5 x 1.6: 2 0,1.5
GEARMOTOR = drill 1.016 pad 1.778: P$1 14,-30; P$2 14,-26 | hole 3.5: 16,-6.27
EXBA = smd 0.7 x 1.2: 1 -2.54,-1.5; 2 -1.27,-1.5; 3 0,-1.5; 4 1.27,-1.5; 5 2.54,-1.5; 6 2.54,1.5; 7 1.27,1.5; 8 0,1.5; 9 -1.27,1.5; 10 -2.54,1.5
SLIDE_SWITCH = drill 0.8: COM 0,0; NC -2,0; NO 2,0 | drill 1: N.C.0 -4,0; N.C.1 4,0

### Placement (x,y rotation side)
C1  75.08,36.98 270 top
C2  64.92,36.98 90 top
C3  54.76,26.82 0 top
C4  54.76,31.9 0 top
C5  85.24,31.9 180 top
C6  85.24,26.82 180 top
D1  54.76,100.48 180 top
D2  54.76,103.02 180 top
D3  54.76,105.56 180 top
D4  54.76,108.1 180 top
D5  54.76,110.64 180 top
D6  54.76,113.18 180 top
D7  85.24,110.64 0 top
D8  85.24,108.1 0 top
D9  85.24,105.56 0 top
D10  85.24,103.02 0 top
D11  85.24,100.48 0 top
D12  85.24,97.94 0 top
D13  59.84,29.36 270 top
D15  54.76,66.19 180 top
D16  54.76,68.73 180 top
D17  54.76,71.27 180 top
D18  54.76,73.81 180 top
D19  54.76,76.35 180 top
D20  54.76,78.89 180 top
D21  85.24,76.35 0 top
D22  85.24,73.81 0 top
D23  85.24,71.27 0 top
D24  85.24,68.73 0 top
D25  85.24,66.19 0 top
D26  85.24,63.65 0 top
IC1  70,105.56 270 top
IC2  36.98,106.83 270 top
IC3  70,71.27 270 top
IC4  103.02,104.29 90 top
IC5  36.98,72.54 270 top
IC6  103.02,70 90 top
IC7  70,52.22 180 top
IC8  95.4,29.36 270 top
IC9  44.6,29.36 90 top
IC10  70,38.25 0 top
IC11  70,125.88 270 top
IC12  70,91.84 90 top
JP1  42.06,57.3 90 top
JP2  97.94,57.3 90 top
JP8  53.49,10.54 180 top
LED_A  11.58,100.48 225 top
LED_B  39.52,128.42 45 top
LED_C  100.48,128.42 135 top
LED_D  128.42,100.48 315 top
LED_E  128.42,39.52 45 top
LED_F  100.48,11.58 225 top
LED_G  39.52,11.58 315 top
LED_H  11.58,39.52 135 top
PH1  15.39,106.83 225 top
PH2  33.17,124.61 45 top
PH3  106.83,124.61 135 top
PH4  124.61,106.83 315 top
PH5  124.61,33.17 45 top
PH6  106.83,15.39 225 top
PH7  33.17,15.39 315 top
PH8  15.39,33.17 135 top
R1  38.25,119.53 315 top
R2  101.75,119.53 225 top
R3  119.53,101.75 225 top
R4  119.53,38.25 135 top
R5  101.75,21.74 135 top
R6  38.25,20.47 45 top
R7  20.78,38.56 45 top
R8  95.4,40.79 270 top
R9  44.6,40.79 270 top
R39  20.47,101.75 315 top
SV1  62.89,106.83 90 top
SV2  77.11,104.29 270 top
SV3  63.02,72.54 90 top
SV4  76.98,70 270 top
SV5  59.84,106.83 90 top
SV6  80.16,104.29 270 top
SV7  59.84,72.54 90 top
SV8  80.16,70 270 top
SV9  24.28,115.72 45 top
SV10  115.72,115.72 315 top
SV11  115.72,24.28 225 top
SV12  24.28,24.28 135 top
SV13  70,45.62 180 top
SV14  52.22,91.59 0 top
SV15  89.05,91.59 0 top
TM1  25.55,110.64 225 top
TM2  29.36,114.45 225 top
TM3  110.64,114.45 135 top
TM4  114.45,110.64 135 top
TM5  114.45,29.36 45 top
TM6  110.64,25.55 45 top
TM7  29.36,25.55 315 top
TM8  25.55,29.36 315 top
TM9  95.4,34.44 180 top
TM10  44.6,34.44 180 top
U$1  104.29,48.41 0 bottom
U$2  35.71,48.41 0 top
U$3  64.92,118.26 270 top
U$4  70,59.59 0 top
U$5  94.13,104.29 90 top
U$6  45.87,72.54 270 top
U$7  70,31.25 180 top
U$9  94.13,70 90 top
U$10  75.08,118.26 270 top
U$11  64.92,83.97 270 top
U$19  45.87,106.83 270 top
U$20  75.08,83.97 270 top

### Tracks (layer width: path | path; a pad name or v marks a point on that pad's centre or on a via)
40XX_CH_A_IN_A
  Top 0.305: U$3.1 62.63,120.8 59.84,118.01 SV5.6 | SV5.6 SV1.6 IC1.1 | IC2.1 35.08,111.28 38.9,115.1 57.37,115.1 58.08,114.38 58.08,113.42 58.32,113.18 SV5.6 | SV5.6 58.57,113.18
40XX_CH_A_IN_B
  Top 0.305: U$3.2 62.63,119.53 60.86,117.75 60.86,115.21 61.62,114.45 66.94,114.45 67.82,113.58 67.82,112.27 IC1.2 SV1.5 SV5.5 58.57,110.64 57.62,111.59 57.62,114.2 57.18,114.64 39.71,114.64 35.08,110 IC2.2
40XX_CH_A_OUT
  Top 0.305: U$3.3 62.63,118.26 61.87,117.5 61.87,115.72 62.69,114.91 67.14,114.91 68.27,113.77 68.27,110.18 IC1.3 SV1.4 SV5.4 58.57,108.1 57.16,109.5 57.16,114.01 56.99,114.19 40.52,114.19 35.08,108.73 IC2.3
40XX_CH_B_IN_A
  Top 0.305: U$3.7 67.21,116.99 69.19,115.01 69.19,106.02 IC1.5 SV1.2 SV5.2 | IC2.5 35.08,106.19 37.79,103.48 37.79,101.05 40.55,98.3 56.45,98.3 57.62,99.46 57.62,102.83 57.81,103.02 SV5.2 | SV5.2 58.57,103.02
40XX_CH_B_IN_B
  Top 0.305: U$3.8 67.21,118.26 69.64,115.82 69.64,103.93 IC1.6 SV1.1 SV5.1 58.57,100.48 58.08,99.99 58.08,99.28 56.64,97.84 40.36,97.84 37.34,100.86 37.34,102.66 35.08,104.92 IC2.6
40XX_CH_B_OUT
  Top 0.305: U$3.6 67.21,115.72 68.73,114.2 68.73,108.1 IC1.4 SV1.3 SV5.3 | SV5.3 58.57,105.56 | SV5.3 58.32,105.56 57.16,104.41 57.16,99.65 56.26,98.75 40.74,98.75 38.25,101.24 38.25,104.29 35.08,107.47 IC2.4
40XX_CH_C_IN_A
  Top 0.305: U$10.1 72.79,120.8 70.36,118.36 70.36,101.39 IC1.8 SV2.6 SV6.6 81.43,97.94 81.92,97.45 81.92,96.73 83.36,95.3 100.38,95.3 104.92,99.84 IC4.1
40XX_CH_C_IN_B
  Top 0.305: U$10.2 72.79,119.53 70.81,117.55 70.81,103.48 IC1.9 SV2.5 SV6.5 82.12,100.48 82.38,100.23 82.38,96.92 83.55,95.76 99.57,95.76 104.92,101.11 IC4.2
40XX_CH_C_OUT
  Top 0.305: U$10.3 72.79,118.26 71.27,116.74 71.27,105.56 IC1.10 SV2.4 SV6.4 82.7,103.02 82.84,102.88 82.84,97.11 83.74,96.21 98.75,96.21 104.92,102.38 IC4.3
40XX_CH_D_IN_A
  Top 0.305: U$10.7 77.37,116.99 79.14,115.21 79.14,113.69 77.11,111.66 72.8,111.66 72.18,111.04 72.18,109.73 IC1.12 SV2.2 SV6.2 82.12,108.1 82.38,108.35 82.38,111.66 82.82,112.1 100.17,112.1 103.48,108.8 103.48,106.37 104.92,104.92 IC4.5
40XX_CH_D_IN_B
  Top 0.305: U$10.8 77.37,118.26 80.16,115.47 SV6.1 | IC1.13 SV2.1 SV6.1 | SV6.1 81.41,110.64 81.92,111.15 81.92,111.84 82.64,112.56 100.36,112.56 103.93,108.99 103.93,107.19 104.92,106.19 IC4.6
40XX_CH_D_OUT
  Top 0.305: U$10.6 77.37,115.72 77.62,115.47 77.62,112.93 76.81,112.11 72.61,112.11 71.73,111.23 71.73,107.64 IC1.11 SV2.3 SV6.3 82.7,105.56 82.84,105.69 82.84,111.47 83.01,111.65 99.98,111.65 103.02,108.61 103.02,105.56 104.92,103.66 IC4.4
40XX_CH_E_IN_A
  Top 0.305: U$11.1 62.63,86.51 59.84,83.72 SV7.6 | SV7.6 SV3.6 IC3.1 | SV7.6 58.32,78.89 58.21,78.99 58.21,79.96 57.35,80.82 39.04,80.82 35.2,76.98 IC5.1
40XX_CH_E_IN_B
  Top 0.305: U$11.2 62.63,85.24 61.36,83.97 61.36,80.67 62.18,79.86 67.25,79.86 67.82,79.29 67.82,77.98 IC3.2 SV3.5 SV7.5 58.32,76.35 57.76,76.91 57.76,79.77 57.16,80.36 39.84,80.36 35.19,75.72 IC5.2
40XX_CH_E_OUT
  Top 0.305: U$11.3 62.63,83.97 61.82,83.16 61.82,80.87 62.38,80.31 67.44,80.31 68.27,79.48 68.27,75.89 IC3.3 SV3.4 SV7.4 58.32,73.81 57.3,74.83 57.3,79.58 56.98,79.91 40.66,79.91 35.2,74.44 IC5.3
40XX_CH_F_IN_A
  Top 0.305: U$11.7 67.21,82.7 69.19,80.72 69.19,71.73 IC3.5 SV3.2 SV7.2 58.32,68.73 57.76,68.17 57.76,65.31 57.16,64.72 40.35,64.72 36.98,68.08 36.98,69.36 36.98,69.75 36.98,70 35.08,71.91 IC5.5
40XX_CH_F_IN_B  (1 unrouted)
  Top 0.305: IC3.6 SV3.1 60.48,66.19 SV7.1 58.57,66.19 58.21,65.83 58.21,65.12 57.35,64.26 40.16,64.26 36.52,67.89 36.52,69.19 35.08,70.64 IC5.6
40XX_CH_F_OUT
  Top 0.305: U$11.6 67.21,81.43 68.73,79.91 68.73,73.81 IC3.4 SV3.3 SV7.3 58.32,71.27 57.3,70.25 57.3,65.5 56.99,65.19 56.04,65.19 56.03,65.17 40.54,65.17 37.62,68.09 37.62,70.64 35.08,73.17 IC5.4
40XX_CH_G_IN_A
  Top 0.305: U$20.1 72.79,86.51 70.36,84.07 70.36,67.1 IC3.8 SV4.6 SV8.6 81.92,63.65 81.92,62.45 83.36,61.01 100.38,61.01 104.92,65.56 IC6.1
40XX_CH_G_IN_B
  Top 0.305: U$20.2 72.79,85.24 70.81,83.26 70.81,69.19 IC3.9 SV4.5 SV8.5 82.06,66.19 82.38,65.88 82.38,62.63 83.55,61.47 99.57,61.47 104.92,66.83 IC6.2
40XX_CH_G_OUT
  Top 0.305: U$20.3 72.79,83.97 71.27,82.45 71.27,71.27 IC3.10 SV4.4 SV8.4 82.7,68.73 82.84,68.59 82.84,62.82 83.74,61.92 98.75,61.92 104.92,68.09 IC6.3
40XX_CH_H_IN_A
  Top 0.305: U$20.7 77.37,82.7 78.13,81.94 78.13,78.13 77.31,77.31 72.75,77.31 72.18,76.75 72.18,75.44 IC3.12 SV4.2 SV8.2 82.06,73.81 82.38,74.12 82.38,77.37 82.82,77.81 99.66,77.81 103.02,74.46 103.02,72.54 104.92,70.64 IC6.5
40XX_CH_H_IN_B
  Top 0.305: U$20.8 77.37,83.97 80.16,81.18 SV8.1 | SV8.1 SV4.1 IC3.13 | IC6.6 104.92,71.91 103.66,73.17 103.66,74.47 99.85,78.27 82.64,78.27 81.92,77.56 81.92,76.84 81.43,76.35 SV8.1
40XX_CH_H_OUT
  Top 0.305: U$20.6 77.37,81.43 77.67,81.12 77.67,79.14 76.3,77.77 72.56,77.77 71.73,76.94 71.73,73.35 IC3.11 SV4.3 SV8.3 82.7,71.27 82.84,71.41 82.84,77.18 83.01,77.36 99.47,77.36 102.38,74.44 102.38,70.64 103.66,69.36 IC6.4
GND  (27 unrouted)
  Top 0.305: R39.1 24.97,108.23 TM1.1 26.53,112.64 28.78,114.88 TM2.1 32.85,120.52 R1.1 | R2.1 108.23,115.03 TM3.1 112.64,113.47 114.88,111.22 TM4.1 120.52,107.15 R3.1 | R5.1 108.42,20.75 TM6.1 111.22,25.12 113.47,27.36 TM5.1 115.03,31.77 R4.1 | R6.1 31.77,24.97 TM7.1 27.36,26.53 25.12,28.78 TM8.1 23.55,33.8 R7.1 | JP8.2 52.22,20.47 56.16,24.41 C4.2 C3.2 | IC10.1 67.26,35.58 C2.1
LDR_CH_A_+  (1 unrouted)
  Top 0.305: R39.2 18.98,100.76 PH1.2
LDR_CH_A_-  (1 unrouted)
LDR_CH_A_OUT  (1 unrouted)
LDR_CH_B_+  (1 unrouted)
  Top 0.305: R1.2 39.24,121.02 PH2.2
LDR_CH_B_-  (1 unrouted)
LDR_CH_B_OUT  (1 unrouted)
LDR_CH_C_+  (1 unrouted)
  Top 0.305: 101.23,119.01 R2.2 100.76,121.02 PH3.2
LDR_CH_C_-  (1 unrouted)
LDR_CH_C_OUT  (1 unrouted)
LDR_CH_D_+  (1 unrouted)
  Top 0.305: R3.2 121.02,100.76 PH4.2
LDR_CH_D_-  (1 unrouted)
LDR_CH_D_OUT  (1 unrouted)
LDR_CH_E_+  (1 unrouted)
  Top 0.305: R4.2 121.02,39.24 PH5.2
LDR_CH_E_-  (1 unrouted)
LDR_CH_E_OUT  (1 unrouted)
LDR_CH_F_+  (1 unrouted)
  Top 0.305: R5.2 100.76,18.98 PH6.2
LDR_CH_F_-  (1 unrouted)
LDR_CH_F_OUT  (1 unrouted)
LDR_CH_G_+  (1 unrouted)
  Top 0.305: R6.2 39.24,18.98 PH7.2
LDR_CH_G_-  (1 unrouted)
LDR_CH_G_OUT  (1 unrouted)
LDR_CH_H_+  (1 unrouted)
  Top 0.305: R7.2 19.29,39.55 PH8.2
LDR_CH_H_-  (1 unrouted)
LDR_CH_H_OUT  (1 unrouted)
LED_CH_A_IN  (1 unrouted)
LED_CH_A_OUT  (1 unrouted)
LED_CH_B_IN  (1 unrouted)
LED_CH_B_OUT  (1 unrouted)
LED_CH_C_IN  (1 unrouted)
  Top 0.305: IC5.7 35.08,69.36
LED_CH_C_OUT  (1 unrouted)
LED_CH_D_IN  (1 unrouted)
  Top 0.305: IC6.7 104.92,73.17
LED_CH_D_OUT  (1 unrouted)
LED_CH_E_IN  (1 unrouted)
LED_CH_F_IN  (1 unrouted)
LED_CH_G_IN  (1 unrouted)
LED_CH_H_IN  (1 unrouted)
MOTOR_A_FWD  (1 unrouted)
MOTOR_A_REV  (1 unrouted)
MOTOR_A_VREF
  Top 0.305: TM9.2 95.4,29.87 96.54,28.73 IC8.6
MOTOR_B_FWD  (1 unrouted)
MOTOR_B_REV  (1 unrouted)
MOTOR_B_VREF
  Top 0.305: TM10.2 44.6,31.39 43.2,29.99 IC9.6
N$1
  Top 0.305: TM9.3 95.4,37.27 R8.2
N$3
  Top 0.305: TM10.3 44.6,37.27 R9.2
N$5  (via drill 0.35)
  Top 0.305: IC2.16 v42.06,111.28 | D6.C v51.59,113.18
  Bottom 0.305: v42.06,111.28 49.68,111.28 v51.59,113.18
N$6
  Top 0.305: IC9.1 49.71,24.95 U$2.P$2
N$7
  Top 0.305: U$2.P$1 43.97,24.16 43.97,27.45 42.7,28.73 IC9.7
N$8  (via drill 0.35)
  Top 0.305: IC2.15 v42.06,110 | D5.C v51.59,110.64
  Bottom 0.305: v42.06,110 50.95,110 v51.59,110.64
N$9  (via drill 0.35)
  Top 0.305: IC2.14 v42.06,108.73 | D4.C v51.59,108.1
  Bottom 0.305: v42.06,108.73 50.95,108.73 v51.59,108.1
N$10  (via drill 0.35)
  Top 0.305: IC2.13 v42.06,107.47 | D3.C v51.59,105.56
  Bottom 0.305: v42.06,107.47 49.68,107.47 v51.59,105.56
N$11  (via drill 0.35)
  Top 0.305: IC2.12 v42.06,106.19 | D2.C v51.59,103.02
  Bottom 0.305: v42.06,106.19 48.41,106.19 v51.59,103.02
N$12  (via drill 0.35)
  Top 0.305: IC2.11 v42.06,104.92 | D1.C v51.59,100.48
  Bottom 0.305: v42.06,104.92 47.14,104.92 v51.59,100.48
N$13  (via drill 0.35)
  Top 0.305: IC6.16 v97.94,65.56 | D26.C v88.41,63.65
  Bottom 0.305: v97.94,65.56 90.32,65.56 v88.41,63.65
N$14  (via drill 0.35)
  Top 0.305: IC4.16 v97.94,99.84 | D12.C v88.41,97.94
  Bottom 0.305: v97.94,99.84 90.32,99.84 v88.41,97.94
N$15  (via drill 0.35)
  Top 0.305: IC4.15 v97.94,101.11 | D11.C v88.41,100.48
  Bottom 0.305: v97.94,101.11 89.05,101.11 v88.41,100.48
N$16  (via drill 0.35)
  Top 0.305: IC4.14 v97.94,102.38 | D10.C v88.41,103.02
  Bottom 0.305: v97.94,102.38 89.05,102.38 v88.41,103.02
N$17  (via drill 0.35)
  Top 0.305: IC4.13 v97.94,103.66 | D9.C v88.41,105.56
  Bottom 0.305: v97.94,103.66 90.32,103.66 v88.41,105.56
N$18  (via drill 0.35)
  Top 0.305: IC4.12 v97.94,104.92 | D8.C v88.41,108.1
  Bottom 0.305: v97.94,104.92 91.59,104.92 v88.41,108.1
N$19  (via drill 0.35)
  Top 0.305: IC4.11 v97.94,106.19 | D7.C v88.41,110.64
  Bottom 0.305: v97.94,106.19 92.86,106.19 v88.41,110.64
N$21  (via drill 0.35)
  Top 0.305: IC6.14 v97.94,68.09 | D24.C v88.41,68.73
  Bottom 0.305: v97.94,68.09 89.05,68.09 v88.41,68.73
N$23  (via drill 0.35)
  Top 0.305: IC5.16 v42.06,76.98 | D20.C v51.59,78.89
  Bottom 0.305: v42.06,76.98 49.68,76.98 v51.59,78.89
N$25  (via drill 0.35)
  Top 0.305: IC5.15 v42.06,75.72 | D19.C v51.59,76.35
  Bottom 0.305: v51.59,76.35 50.95,75.72 v42.06,75.72
N$27  (via drill 0.35)
  Top 0.305: IC5.14 v42.06,74.44 | D18.C v51.59,73.81
  Bottom 0.305: v51.59,73.81 50.95,74.44 v42.06,74.44
N$29  (via drill 0.35)
  Top 0.305: IC5.13 v42.06,73.17 | D17.C v51.59,71.27
  Bottom 0.305: v51.59,71.27 49.68,73.17 v42.06,73.17
N$31  (via drill 0.35)
  Top 0.305: IC5.12 v42.06,71.91 | D16.C v51.59,68.73
  Bottom 0.305: v51.59,68.73 48.41,71.91 v42.06,71.91
N$32  (via drill 0.35)
  Top 0.305: IC5.11 v42.06,70.64 | D15.C v51.59,66.19
  Bottom 0.305: v51.59,66.19 47.14,70.64 v42.06,70.64
N$33  (via drill 0.35)
  Top 0.305: IC6.15 v97.94,66.83 | D25.C v88.41,66.19
  Bottom 0.305: v97.94,66.83 89.05,66.83 v88.41,66.19
N$34  (via drill 0.35)
  Top 0.305: IC6.13 v97.94,69.36 | D23.C v88.41,71.27
  Bottom 0.305: v97.94,69.36 90.32,69.36 v88.41,71.27
N$35  (via drill 0.35)
  Top 0.305: IC6.12 v97.94,70.64 | D22.C v88.41,73.81
  Bottom 0.305: v97.94,70.64 91.59,70.64 v88.41,73.81
N$38  (via drill 0.35)
  Top 0.305: IC6.11 v97.94,71.91 | D21.C v88.41,76.35
  Bottom 0.305: v97.94,71.91 92.86,71.91 v88.41,76.35
N$44  (1 unrouted)
N$45  (1 unrouted)
N$46  (1 unrouted)
N$47  (1 unrouted)
N$48  (1 unrouted)
N$49  (1 unrouted)
N$50  (1 unrouted)
N$51  (1 unrouted)
N$52  (1 unrouted)
N$53  (1 unrouted)
N$54  (1 unrouted)
N$55  (1 unrouted)
N$61
  Top 0.61: JP8.1 54.76,20.22 59.84,25.3 D13.A
N$82
  Top 0.305: U$1.P$2 94.13,26.25 94.13,30.63 93.5,31.27 IC8.1
N$83
  Top 0.305: U$1.P$1 98.06,26.19 99.21,26.19 99.84,26.82 99.84,29.36 99.21,29.99 IC8.7
OUTPUT_A_IN  (1 unrouted)
OUTPUT_A_OUT  (1 unrouted)
OUTPUT_B_IN  (1 unrouted)
OUTPUT_B_OUT  (1 unrouted)
RES_D1
  Top 0.305: D1.A 54.99,99.21 51.59,99.21 47.37,103.42 U$19.6
RES_D2
  Top 0.305: D2.A 54.99,101.75 51.59,101.75 47.77,105.56 U$19.7
RES_D3
  Top 0.305: D3.A 54.99,104.29 51.59,104.29 49.05,106.83 U$19.8
RES_D4
  Top 0.305: D4.A 54.99,106.83 51.59,106.83 47.47,110.94 44.91,110.94 44.35,110.39 44.35,109.39 U$19.1
RES_D5
  Top 0.305: D5.A 54.99,109.37 51.59,109.37 49.55,111.4 44.23,111.4 43.28,110.45 43.28,108.41 43.58,108.1 U$19.2
RES_D6
  Top 0.305: D6.A 54.99,111.91 44.09,111.91 42.82,110.64 42.82,107.34 43.33,106.83 U$19.3
RES_D7
  Top 0.305: D7.A 85.01,109.37 89.3,109.37 91.84,106.83 U$5.6
RES_D8
  Top 0.305: D8.A 85.01,106.83 88.03,106.83 88.41,106.83 90.57,106.83 91.84,105.56 U$5.7
RES_D9
  Top 0.305: D9.A 85.01,104.29 88.29,104.29 88.41,104.29 U$5.8
RES_D10
  Top 0.305: D10.A 85.01,101.75 88.41,101.75 89.18,100.99 95.65,100.99 95.65,101.73 U$5.1
RES_D11
  Top 0.305: D11.A 85.01,99.21 94.83,99.21 96.8,101.18 96.8,102.64 96.42,103.02 U$5.2
RES_D12
  Top 0.305: D12.A 85.01,96.67 92.94,96.67 97.26,100.99 97.26,103.45 96.42,104.29 U$5.3
RES_D15  (1 unrouted)
RES_D16
  Top 0.305: D16.A 54.99,67.46 51.59,67.46 47.77,71.27 U$6.7
RES_D17
  Top 0.305: D17.A 54.99,70 51.59,70 49.05,72.54 U$6.8
RES_D18
  Top 0.305: D18.A 54.99,72.54 51.59,72.54 48.03,76.1 44.85,76.1 44.37,75.61 U$6.1
RES_D19
  Top 0.305: D19.A 56.26,76.07 55.27,75.08 51.71,75.08 49.93,76.86 43.84,76.86 43.33,76.35 43.33,74.06 43.58,73.81 U$6.2
RES_D20
  Top 0.305: D20.A 54.99,77.62 43.58,77.62 42.82,76.86 42.82,73.3 43.58,72.54 U$6.3
RES_D21
  Top 0.305: D21.A 85.01,75.08 88.29,75.08 88.41,75.08 89.3,75.08 91.84,72.54 U$9.6
RES_D22
  Top 0.305: D22.A 85.01,72.54 88.29,72.54 88.41,72.54 90.57,72.54 91.84,71.27 U$9.7
RES_D23
  Top 0.305: D23.A 85.01,70 U$9.8
RES_D24
  Top 0.305: D24.A 85.01,67.46 88.41,67.46 89.18,66.7 95.4,66.7 95.63,66.93 U$9.1
RES_D25
  Top 0.305: D25.A 85.01,64.92 95.91,64.92 96.8,65.81 96.8,68.35 96.42,68.73 U$9.2
RES_D26
  Top 0.305: D26.A 85.01,62.38 94.64,62.38 97.26,65 97.26,69.16 96.42,70 U$9.3
VBAT
  Top 0.61: D13.C 61.55,31.71 63.9,29.36 68.11,29.36 U$7.COM
VDD  (38 unrouted)
  Top 0.305: IC1.14 73.81,115.49 U$10.5 74.57,115.72 75.08,116.23 75.08,120.29 75.59,120.8 U$10.10 | U$3.5 64.41,115.72 64.92,116.23 64.92,120.29 65.43,120.8 U$3.10 | U$11.10 65.43,86.51 64.92,86 64.92,81.94 64.41,81.43 U$11.5 | U$20.10 75.59,86.51 75.08,86 75.08,81.94 74.57,81.43 U$20.5 | PH1.1 SV9.1 TM1.3 23.55,112.71 24.24,113.39 24.25,113.39 24.81,113.95 24.81,113.97 25.88,115.03 TM2.3 27.62,115.29 27.62,116.57 28.77,117.72 SV9.6 PH2.1 | PH6.1 SV11.6 111.23,22.28 112.64,23.69 TM6.3 114.12,24.97 115.19,26.03 115.19,26.05 116.45,27.31 TM5.3 SV11.1 PH5.1 | PH8.1 SV12.6 22.09,28.77 23.5,27.36 TM8.3 24.97,25.88 26.03,24.81 26.05,24.81 27.31,23.55 TM7.3 SV12.1 PH7.1 | PH4.1 SV10.6 117.91,111.23 116.98,112.16 116.98,112.17 116.52,112.64 TM4.3 115.03,114.12 113.97,115.19 113.95,115.19 113.39,115.75 113.39,115.76 112.71,116.45 TM3.3 SV10.1 PH3.1 | IC10.2 70.03,36.45 68.09,38.38 C2.2 | C6.1 88.55,28.73 IC8.3 | C4.1 51.45,29.99 IC9.3
VIN  (2 unrouted)
  Top 0.305: IC10.3 72.79,35.58 C1.2 | C5.1 88.55,29.99 IC8.2 | IC9.2 51.45,28.73 C3.1
  Top 0.61: U$7.NC 72,34.79 IC10.3

### Text on the board
_tsilk: Designed by / Jelle Reith / July 2021 | Battle Bits PCB V3.0 | 7400 Series logic gate | 1 | 14 | VDD | 2 | 13 | 3 | 12 | 4 | 11 | 5 | 10 | 6 | 9 | GND | 7 | 8 | 7400 Series logic gate | 1 | 14 | VDD | 2 | 13 | 3 | 12 | 4 | 11 | 5 | 10 | 6 | 9 | GND | 7 | 8 | OUTPUT A | OUTPUT B | + | + | MAX 500 mA | MAX 500 mA | - | - | OUTPUT B | OUTPUT A | L MOTOR REV | R MOTOR FWD | L MOTOR FWD | R MOTOR REV | github.com/ipibo/BattleBitsWorkshop | 0 | 1 | +V_BAT | - V_BAT